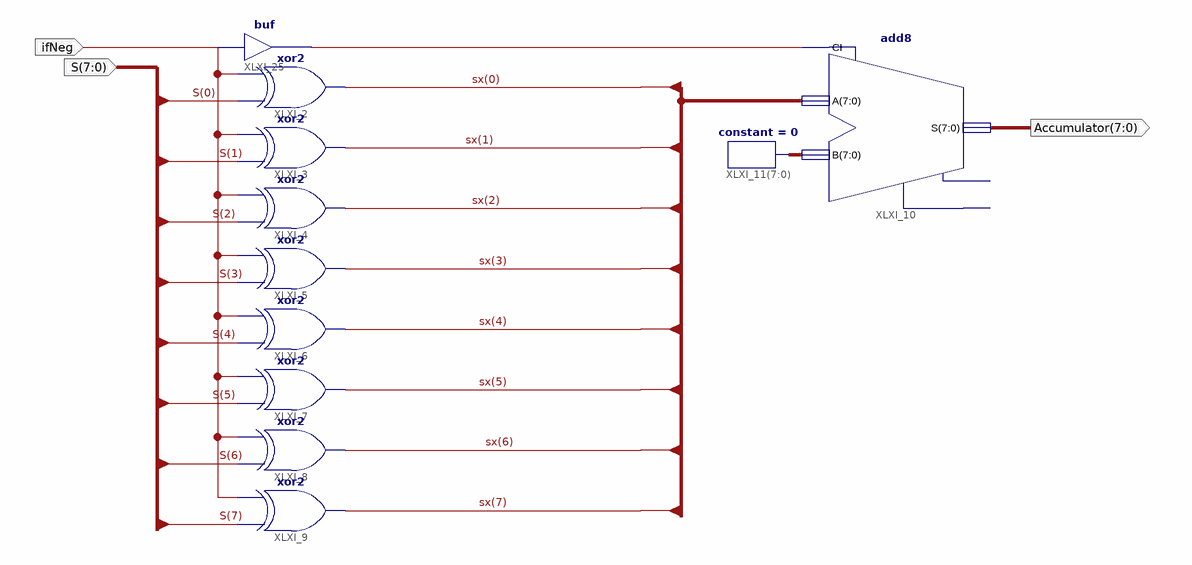
[diagram p0: schematic sheet 1]
// Xilinx ISE schematic twos_comp.sch (spartan3e) as structural Verilog: 11 symbols, 3 ports
module twos_comp (
  input  [7:0] S,
  input  ifNeg,
  output [7:0] Accumulator
);

  wire XLXN_34;
  wire [7:0] sx, XLXN_21;

  xor XLXI_2 (sx[0], S[0], ifNeg);
  xor XLXI_3 (sx[1], S[1], ifNeg);
  xor XLXI_4 (sx[2], S[2], ifNeg);
  xor XLXI_5 (sx[3], S[3], ifNeg);
  xor XLXI_6 (sx[4], S[4], ifNeg);
  xor XLXI_7 (sx[5], S[5], ifNeg);
  xor XLXI_8 (sx[6], S[6], ifNeg);
  xor XLXI_9 (sx[7], S[7], ifNeg);
  add8 XLXI_10 (.A(sx), .B(XLXN_21), .CI(XLXN_34), .S(Accumulator));  // open: CO, OFL
  constant #(.CValue("0")) XLXI_11[7:0] (.O(XLXN_21));
  buf XLXI_25 (XLXN_34, ifNeg);
endmodule
